# EAGLE design Internal A (EAGLE 7.5.0)
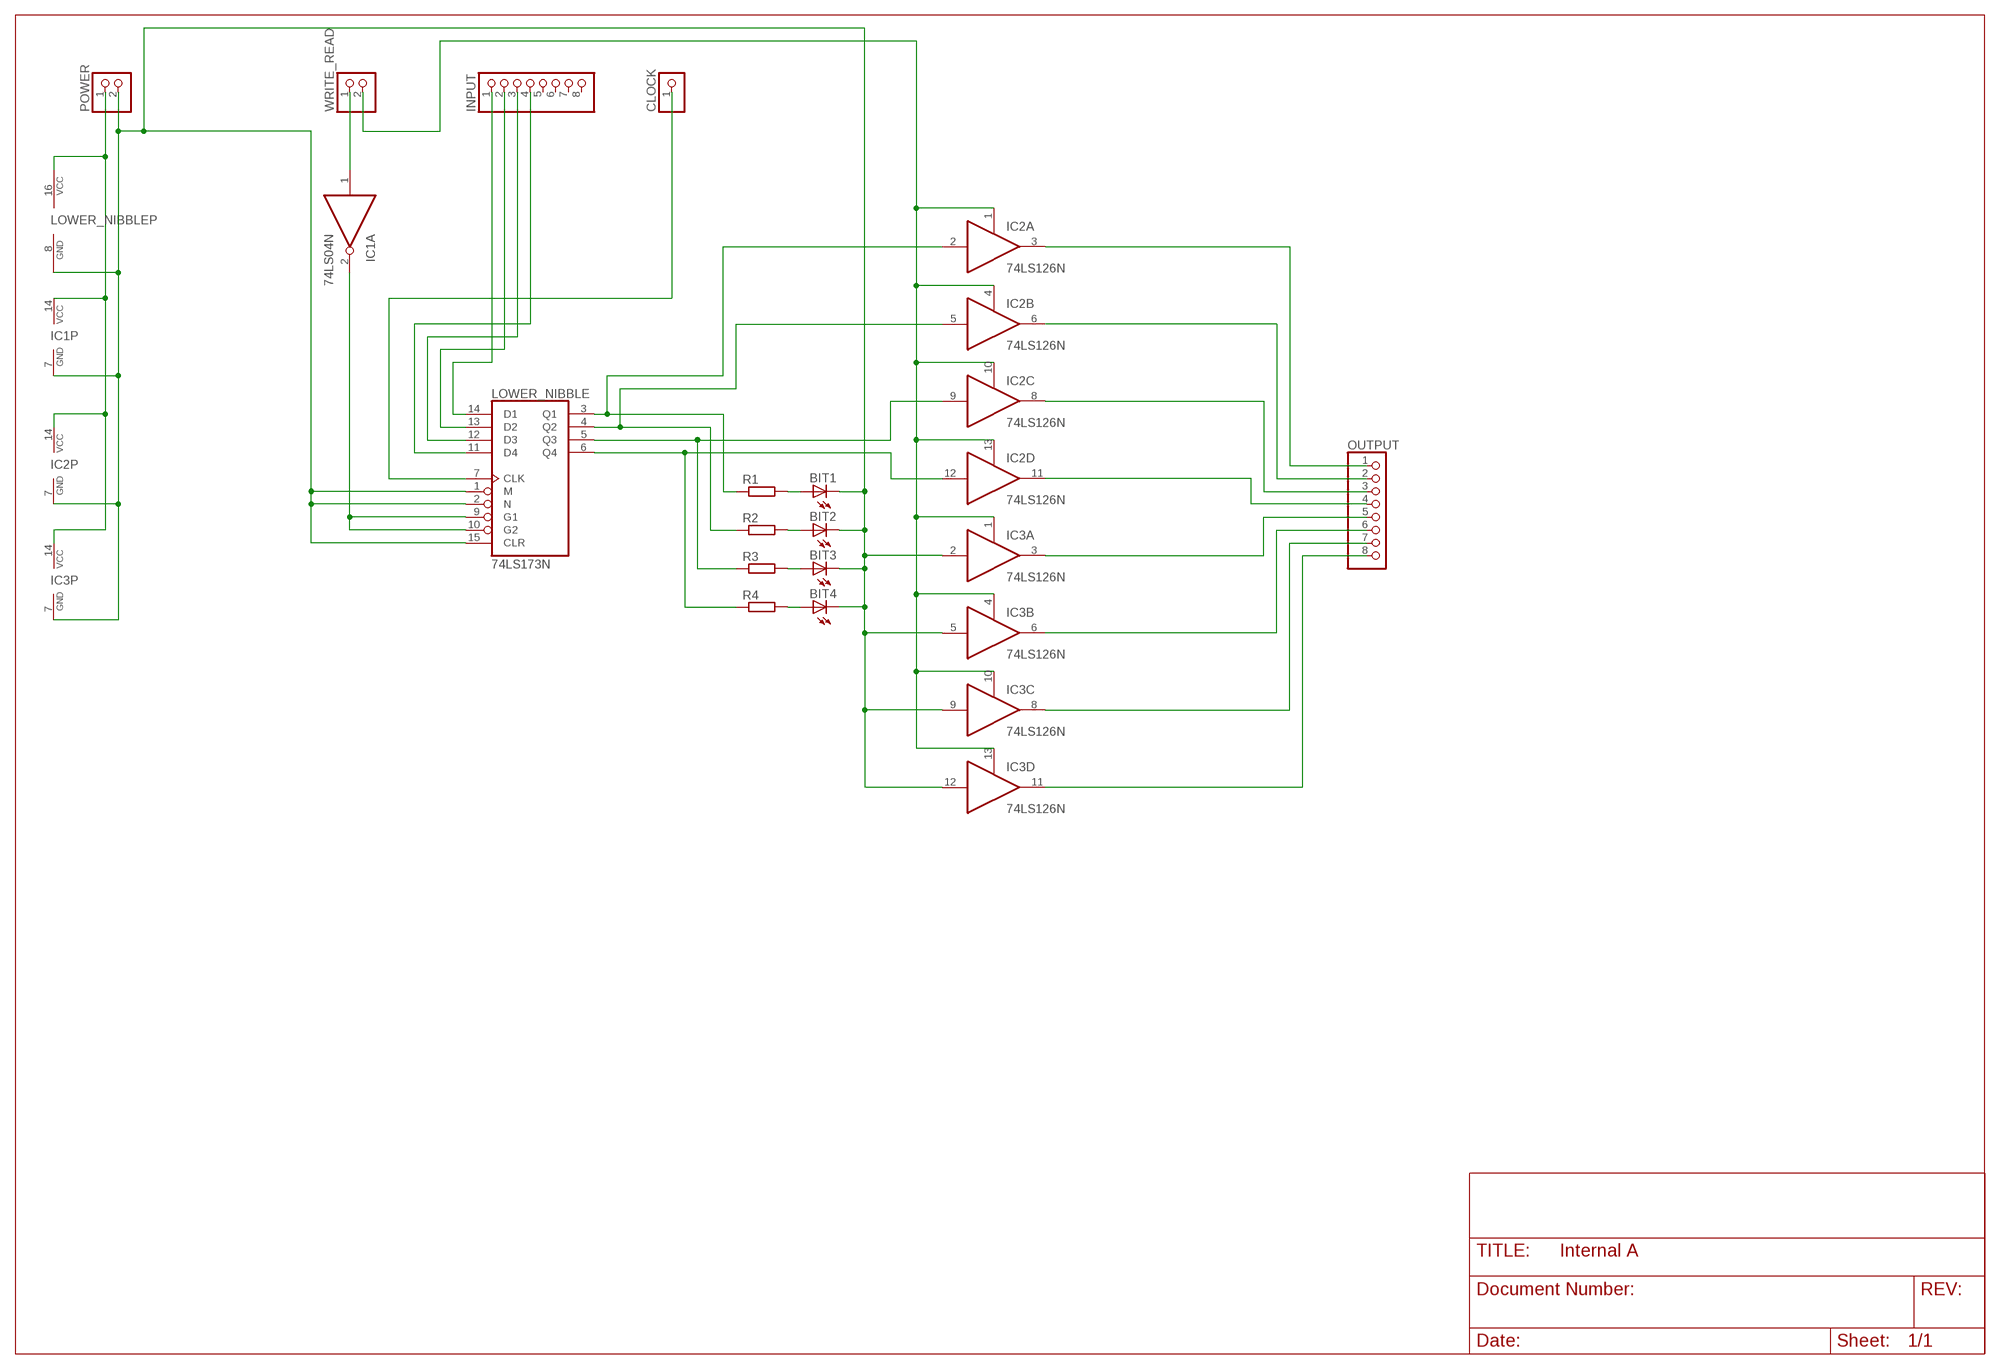
[diagram p0: schematic, sheet 1]

## Parts
BIT1  LED3MM  [LED3MM]
BIT2  LED3MM  [LED3MM]
BIT3  LED3MM  [LED3MM]
BIT4  LED3MM  [LED3MM]
CLOCK  PINHD-1X1  [1X01]
IC1  74LS04N  [DIL14]
IC2  74LS126N  [DIL14]
IC3  74LS126N  [DIL14]
INPUT  PINHD-1X8  [1X08]
LOWER_NIBBLE  74LS173N  [DIL16]
OUTPUT  PINHD-1X8  [1X08]
POWER  PINHD-1X2  [1X02]
R1  R-EU_0207/10  [0207/10]
R2  R-EU_0207/10  [0207/10]
R3  R-EU_0207/10  [0207/10]
R4  R-EU_0207/10  [0207/10]
WRITE_READ  PINHD-1X2  [1X02]

## Nets
GND: BIT1.K(C) BIT2.K(C) BIT3.K(C) BIT4.K(C) IC1.7(P:GND) IC2.7(P:GND) IC3.2(A:I) IC3.5(B:I) IC3.7(P:GND) IC3.9(C:I) IC3.12(D:I) LOWER_NIBBLE.1(M) LOWER_NIBBLE.2(N) LOWER_NIBBLE.8(GND) LOWER_NIBBLE.15(CLR) POWER.2
N$2: IC1.1(A:I) WRITE_READ.1
N$3: BIT1.A R1.2
N$5: BIT2.A R2.2
N$6: BIT3.A R3.2
N$7: BIT4.A R4.2
N$11: IC2.11(D:O) OUTPUT.4
N$12: IC1.2(A:O) LOWER_NIBBLE.9(G1) LOWER_NIBBLE.10(G2)
N$13: CLOCK.1 LOWER_NIBBLE.7(CLK)
N$14: INPUT.1 LOWER_NIBBLE.14(D1)
N$15: INPUT.2 LOWER_NIBBLE.13(D2)
N$16: INPUT.3 LOWER_NIBBLE.12(D3)
N$17: INPUT.4 LOWER_NIBBLE.11(D4)
N$22: IC2.2(A:I) LOWER_NIBBLE.3(Q1) R1.1
N$23: IC2.5(B:I) LOWER_NIBBLE.4(Q2) R2.1
N$24: IC2.9(C:I) LOWER_NIBBLE.5(Q3) R3.1
N$25: IC2.12(D:I) LOWER_NIBBLE.6(Q4) R4.1
N$30: IC2.1(A:OE) IC2.4(B:OE) IC2.10(C:OE) IC2.13(D:OE) IC3.1(A:OE) IC3.4(B:OE) IC3.10(C:OE) IC3.13(D:OE) WRITE_READ.2
N$31: IC2.3(A:O) OUTPUT.1
N$32: IC2.6(B:O) OUTPUT.2
N$33: IC2.8(C:O) OUTPUT.3
N$35: IC3.3(A:O) OUTPUT.5
N$36: IC3.6(B:O) OUTPUT.6
N$37: IC3.8(C:O) OUTPUT.7
N$38: IC3.11(D:O) OUTPUT.8
VCC: IC1.14(P:VCC) IC2.14(P:VCC) IC3.14(P:VCC) LOWER_NIBBLE.16(VCC) POWER.1
Unconnected: IC1.3(B:I) IC1.4(B:O) IC1.5(C:I) IC1.6(C:O) IC1.8(D:O) IC1.9(D:I) IC1.10(E:O) IC1.11(E:I) IC1.12(F:O) IC1.13(F:I) INPUT.5 INPUT.6 INPUT.7 INPUT.8

## Library data of the parts
BIT1-BIT4 = led:LED: LED OSRAM: - CHIPLED LG R971, LG N971, LY N971, LG Q971, LY Q971, LO R971, LY R971 LH N974, LH R974 LS Q976, LO Q976, LY Q976 LO Q996 - Hyper CHIPLED LW Q18S LB Q993, LB Q99A, LB R99A - SideLED LS A670, LO A670, LY A670, LG A670, LP A670 LB A673, LV A673, LT A673, LW A673 LH A674 LY A675 LS A676, LA A676, LO A676, LY A676, LW A676 LS A679, LY A679, LG A679 - Hyper Micro SIDELED® LS Y876, LA Y876, LO Y876, LY Y876 LT Y87S - SmartLED LW L88C, LW L88S LB L89C, LB L89S, LG L890 LS L89K, LO L89K, LY L89K LS L896, LA L896, LO L896, LY L896 - TOPLED LS T670, LO T670, LY T670, LG T670, LP T670 LSG T670, LSP T670, LSY T670, LOP T670, LYG T670 LG T671, LOG T671, LSG T671 LB T673, LV T673, LT T673, LW T673 LH T674 LS T676, LA T676, LO T676, LY T676, LB T676, LH T676, LSB T676, LW T676 LB T67C, LV T67C, LT T67C, LS T67K, LO T67K, LY T67K, LW E67C LS E67B, LA E67B, LO E67B, LY E67B, LB E67C, LV E67C, LT E67C LW T67C LS T679, LY T679, LG T679 LS T770, LO T770, LY T770, LG T770, LP T770 LB T773, LV T773, LT T773, LW T773 LH T774 LS E675, LA E675, LY E675, LS T675 LS T776, LA T776, LO T776, LY T776, LB T776 LHGB T686 LT T68C, LB T68C - Hyper Mini TOPLED® LB M676 - Mini TOPLED Santana® LG M470 LS M47K, LO M47K, LY M47K Source: http://www.osram.convergy.de LUXEON: - LUMILED® LXK2-PW12-R00, LXK2-PW12-S00, LXK2-PW14-U00, LXK2-PW14-V00 LXK2-PM12-R00, LXK2-PM12-S00, LXK2-PM14-U00 LXK2-PE12-Q00, LXK2-PE12-R00, LXK2-PE12-S00, LXK2-PE14-T00, LXK2-PE14-U00 LXK2-PB12-K00, LXK2-PB12-L00, LXK2-PB12-M00, LXK2-PB14-N00, LXK2-PB14-P00, LXK2-PB14-Q00 LXK2-PR12-L00, LXK2-PR12-M00, LXK2-PR14-Q00, LXK2-PR14-R00 LXK2-PD12-Q00, LXK2-PD12-R00, LXK2-PD12-S00 LXK2-PH12-R00, LXK2-PH12-S00 LXK2-PL12-P00, LXK2-PL12-Q00, LXK2-PL12-R00 Source: www.luxeon.com KINGBRIGHT: KA-3528ASYC Source: www.kingbright.com
CLOCK = pinhead:PINHD-1X1: PIN HEADER
IC1 = 74xx-eu:74*04: Hex INVERTER
IC2 IC3 = 74xx-eu:74*126: Quad bus BUFFER, 3-state
INPUT OUTPUT = pinhead:PINHD-1X8: PIN HEADER
LOWER_NIBBLE = 74xx-us:74*173: 4-bit D type REGISTER, 3-state
POWER WRITE_READ = pinhead:PINHD-1X2: PIN HEADER
R1-R4 = resistor:R-EU_: RESISTOR, European symbol

## Board
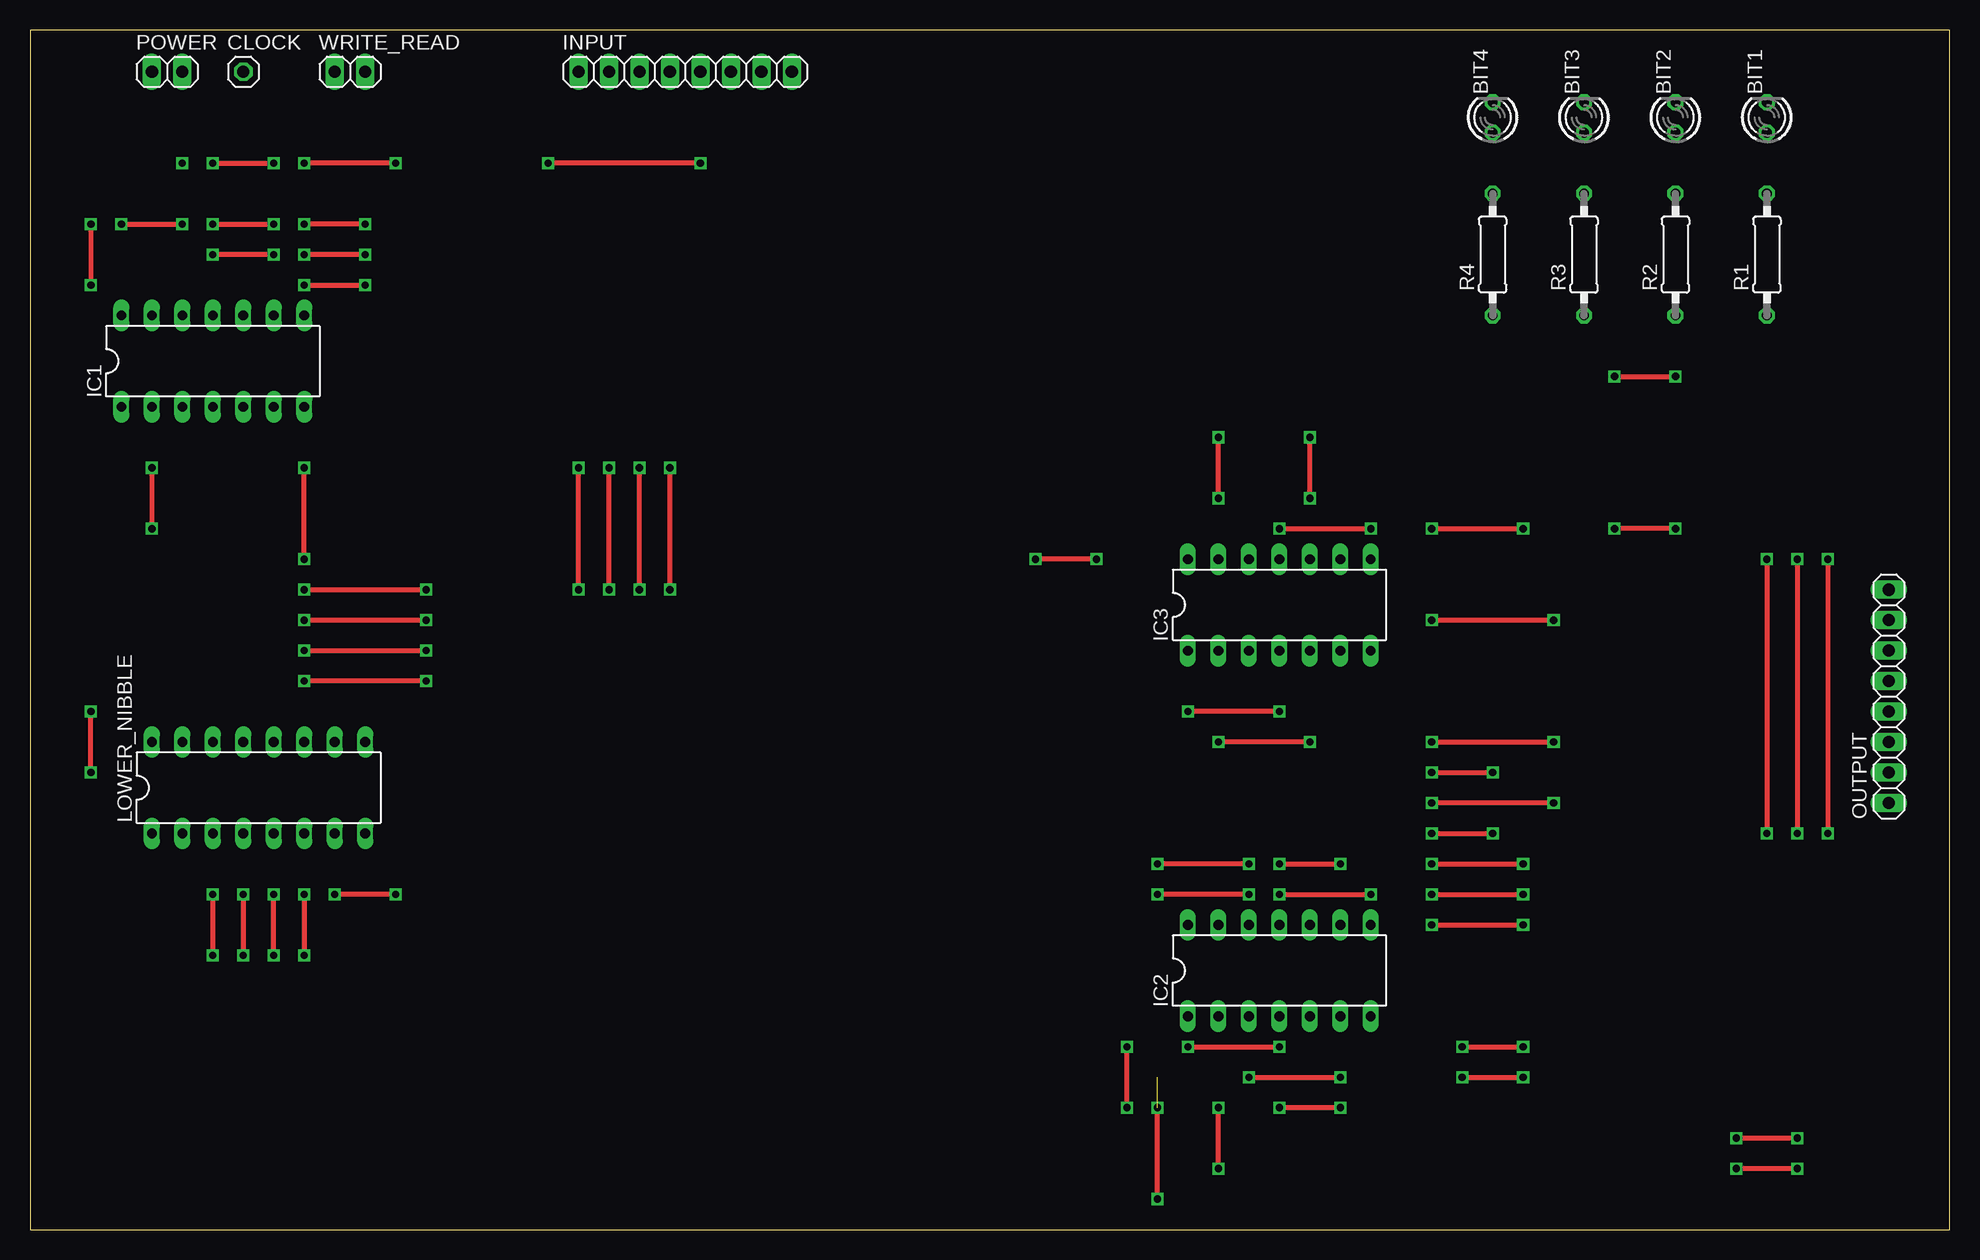
[diagram p1: board, top side]
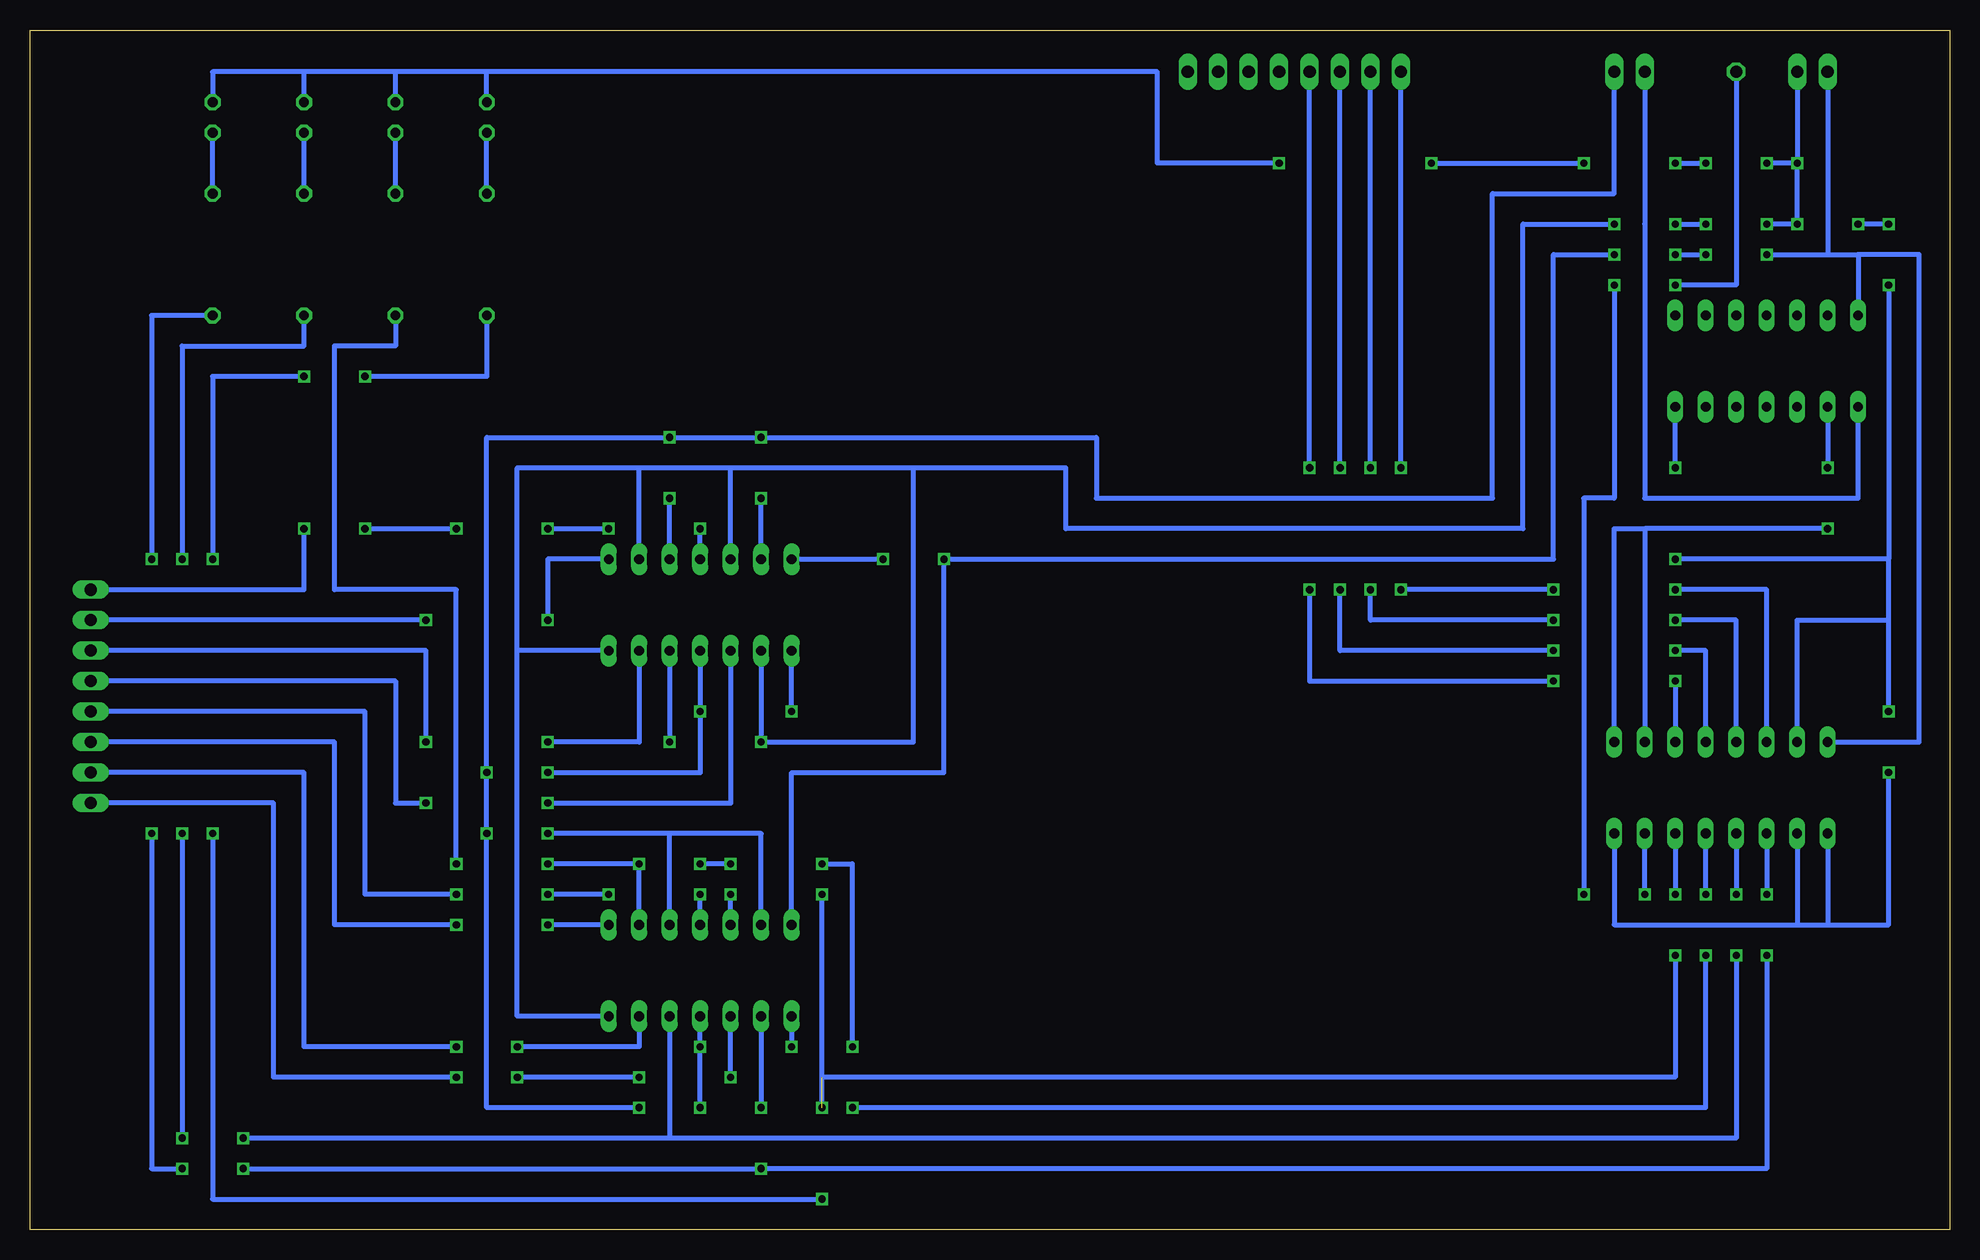
[diagram p2: board, bottom side, seen from below]

Size 160 x 100 mm. Coordinates in mm from the lower left corner, seen from the top.
Outline: 0,0 160,0 160,100 0,100 0,0
Copper layers (1*16): Top 0.035mm / dielectric 1.5mm / Bottom 0.035mm
Design rules "default": minimum track width 10mil, minimum drill 24mil, track to track 8mil, track to pad 8mil, pad to pad 8mil, via to via 8mil, smd to smd 8mil, copper to edge 40mil, drill to drill 8mil, minimum pad ring 10mil, minimum via ring 8mil, stop-mask expansion 4mil, vias tented up to drill 0mil, thermal gap 10mil

### Footprints (pad centres in the part's own frame; a part is rotated, then mirrored left to right if it is on the bottom)
LED3MM = drill 0.813 octagon: A -1.27,0; K 1.27,0
1X01 = drill 1.016 octagon: 1 0,0
DIL14 = drill 0.813 long: 1 -7.62,-3.81; 2 -5.08,-3.81; 3 -2.54,-3.81; 4 0,-3.81; 5 2.54,-3.81; 6 5.08,-3.81; 7 7.62,-3.81; 8 7.62,3.81; 9 5.08,3.81; 10 2.54,3.81; 11 0,3.81; 12 -2.54,3.81; 13 -5.08,3.81; 14 -7.62,3.81
1X08 = drill 1.016 long: 1 -8.89,0; 2 -6.35,0; 3 -3.81,0; 4 -1.27,0; 5 1.27,0; 6 3.81,0; 7 6.35,0; 8 8.89,0
DIL16 = drill 0.813 long: 1 -8.89,-3.81; 2 -6.35,-3.81; 3 -3.81,-3.81; 4 -1.27,-3.81; 5 1.27,-3.81; 6 3.81,-3.81; 7 6.35,-3.81; 8 8.89,-3.81; 9 8.89,3.81; 10 6.35,3.81; 11 3.81,3.81; 12 1.27,3.81; 13 -1.27,3.81; 14 -3.81,3.81; 15 -6.35,3.81; 16 -8.89,3.81
1X02 = drill 1.016 long: 1 -1.27,0; 2 1.27,0
0207/10 = drill 0.813 octagon: 1 -5.08,0; 2 5.08,0

### Placement (x,y rotation side)
BIT1  144.78,92.71 90 top
BIT2  137.16,92.71 90 top
BIT3  129.54,92.71 90 top
BIT4  121.92,92.71 90 top
CLOCK  17.78,96.52 0 top
IC1  15.24,72.39 0 top
IC2  104.14,21.59 0 top
IC3  104.14,52.07 0 top
INPUT  54.61,96.52 0 top
LOWER_NIBBLE  19.05,36.83 0 top
OUTPUT  154.94,44.45 90 top
POWER  11.43,96.52 0 top
R1  144.78,81.28 90 top
R2  137.16,81.28 90 top
R3  129.54,81.28 90 top
R4  121.92,81.28 90 top
WRITE_READ  26.67,96.52 0 top

### Tracks (layer width: path | path; a pad name or v marks a point on that pad's centre or on a via)
GND  (via drill 0.6)
  Top 0.406: v5.08,83.82 v5.08,78.74 | v22.86,55.88 v22.86,63.5 | v5.08,38.1 v5.08,43.18 | v27.94,83.82 v22.86,83.82 | v30.48,88.9 v22.86,88.9 | v55.88,88.9 v43.18,88.9 | v106.68,40.64 v99.06,40.64 | v15.24,88.9 v20.32,88.9 | v15.24,83.82 v20.32,83.82 | v7.62,83.82 v12.7,83.82
  Bottom 0.406: POWER.2 v12.7,88.9 | v5.08,78.74 5.08,55.88 | 5.08,55.88 v22.86,55.88 | v22.86,63.5 IC1.7 | 12.7,25.4 10.16,25.4 | 10.16,25.4 5.08,25.4 v5.08,38.1 | v5.08,43.18 5.08,50.8 | 5.08,50.8 5.08,55.88 | LOWER_NIBBLE.1 10.16,25.4 | LOWER_NIBBLE.2 12.7,25.4 | LOWER_NIBBLE.15 12.7,50.8 5.08,50.8 | v27.94,83.82 35.56,83.82 35.56,58.42 73.66,58.42 73.66,63.5 86.36,63.5 | v22.86,83.82 v20.32,83.82 | 119.38,48.26 119.38,17.78 IC2.7 | 119.38,48.26 119.38,63.5 109.22,63.5 | v43.18,88.9 v30.48,88.9 | v22.86,88.9 v20.32,88.9 | 86.36,63.5 101.6,63.5 | 101.6,63.5 109.22,63.5 | 121.92,96.52 66.04,96.52 66.04,88.9 v55.88,88.9 | 121.92,96.52 129.54,96.52 | 129.54,96.52 137.16,96.52 | 137.16,96.52 144.78,96.52 BIT1.K | BIT4.K 121.92,96.52 | BIT3.K 129.54,96.52 | BIT2.K 137.16,96.52 | IC3.7 119.38,48.26 | IC3.5 v106.68,40.64 | 86.36,63.5 86.36,40.64 v99.06,40.64 IC3.2 | IC3.9 109.22,63.5 | IC3.12 101.6,63.5 | LOWER_NIBBLE.8 27.94,25.4 12.7,25.4 | v12.7,88.9 v15.24,88.9 | v15.24,83.82 v12.7,83.82 v12.7,88.9 | v5.08,83.82 v7.62,83.82
N$2
  Bottom 0.406: WRITE_READ.1 25.4,83.82 25.4,60.96 7.62,60.96 IC1.1
N$3
  Bottom 0.406: R1.2 BIT1.A
N$5
  Bottom 0.406: R2.2 BIT2.A
N$6
  Bottom 0.406: R3.2 BIT3.A
N$7
  Bottom 0.406: R4.2 BIT4.A
N$11  (via drill 0.6)
  Top 0.406: v104.14,27.94 v111.76,27.94 | v116.84,27.94 v124.46,27.94
  Bottom 0.406: IC2.11 v104.14,27.94 | v111.76,27.94 v116.84,27.94 | v124.46,27.94 132.08,27.94 132.08,43.18 OUTPUT.4
N$12  (via drill 0.6)
  Top 0.406: v10.16,63.5 v10.16,58.42
  Bottom 0.406: IC1.2 v10.16,63.5 | v10.16,58.42 25.4,58.42 | 25.4,58.42 LOWER_NIBBLE.10 | LOWER_NIBBLE.9 27.94,58.42 25.4,58.42
N$13  (via drill 0.6)
  Top 0.406: v22.86,78.74 v27.94,78.74 | v30.48,27.94 v25.4,27.94
  Bottom 0.406: CLOCK.1 17.78,78.74 v22.86,78.74 | v27.94,78.74 27.94,60.96 30.48,60.96 v30.48,27.94 | v25.4,27.94 LOWER_NIBBLE.7
N$14  (via drill 0.6)
  Top 0.406: v22.86,53.34 v33.02,53.34 | v45.72,53.34 v45.72,63.5
  Bottom 0.406: LOWER_NIBBLE.14 15.24,53.34 v22.86,53.34 | v33.02,53.34 v45.72,53.34 | v45.72,63.5 INPUT.1
N$15  (via drill 0.6)
  Top 0.406: v22.86,50.8 v33.02,50.8 | v48.26,53.34 v48.26,63.5
  Bottom 0.406: LOWER_NIBBLE.13 17.78,50.8 v22.86,50.8 | v33.02,50.8 48.26,50.8 v48.26,53.34 | v48.26,63.5 INPUT.2
N$16  (via drill 0.6)
  Top 0.406: v22.86,48.26 v33.02,48.26 | v50.8,53.34 v50.8,63.5
  Bottom 0.406: LOWER_NIBBLE.12 20.32,48.26 v22.86,48.26 | v33.02,48.26 50.8,48.26 v50.8,53.34 | v50.8,63.5 INPUT.3
N$17  (via drill 0.6)
  Top 0.406: v33.02,45.72 v22.86,45.72 | v53.34,53.34 v53.34,63.5
  Bottom 0.406: v33.02,45.72 53.34,45.72 v53.34,53.34 | v22.86,45.72 LOWER_NIBBLE.11 | v53.34,63.5 INPUT.4
N$22  (via drill 0.6)
  Top 0.406: v15.24,27.94 v15.24,22.86 | v99.06,5.08 v99.06,10.16 | v149.86,55.88 v149.86,33.02 | v147.32,5.08 v142.24,5.08
  Bottom 0.406: LOWER_NIBBLE.3 v15.24,27.94 | v15.24,22.86 15.24,5.08 v99.06,5.08 v142.24,5.08 | v149.86,33.02 149.86,5.08 v147.32,5.08 | R1.1 149.86,76.2 v149.86,55.88 | IC2.2 v99.06,10.16
N$23  (via drill 0.6)
  Top 0.406: v17.78,27.94 v17.78,22.86 | v147.32,55.88 v147.32,33.02 | v147.32,7.62 v142.24,7.62
  Bottom 0.406: LOWER_NIBBLE.4 v17.78,27.94 | v17.78,22.86 17.78,7.62 106.68,7.62 | 106.68,7.62 v142.24,7.62 | v147.32,33.02 v147.32,7.62 | v147.32,55.88 147.32,73.66 137.16,73.66 R2.1 | IC2.5 106.68,7.62
N$24  (via drill 0.6)
  Top 0.406: v91.44,10.16 v91.44,15.24 | v101.6,30.48 v93.98,30.48 | v116.84,30.48 v124.46,30.48 | v20.32,22.86 v20.32,27.94 | v104.14,30.48 v109.22,30.48
  Bottom 0.406: v91.44,10.16 20.32,10.16 v20.32,22.86 | v91.44,15.24 91.44,30.48 v93.98,30.48 | v116.84,30.48 v109.22,30.48 IC2.9 | R3.1 129.54,73.66 134.62,73.66 134.62,53.34 124.46,53.34 v124.46,30.48 | v20.32,27.94 LOWER_NIBBLE.5 | v101.6,30.48 v104.14,30.48
N$25  (via drill 0.6)  (1 unrouted)
  Top 0.406: v22.86,27.94 v22.86,22.86 | v144.78,55.88 v144.78,33.02 | v93.98,2.54 v93.98,10.16 | v101.6,27.94 v93.98,27.94 | v132.08,71.12 v137.16,71.12
  Bottom 0.406: LOWER_NIBBLE.6 v22.86,27.94 | v93.98,10.16 93.98,12.7 | 93.98,12.7 v93.98,27.94 | v144.78,33.02 144.78,2.54 v93.98,2.54 | R4.1 121.92,71.12 v132.08,71.12 | v137.16,71.12 144.78,71.12 v144.78,55.88 | IC2.12 v101.6,27.94 | v22.86,22.86 22.86,12.7 93.98,12.7
N$30  (via drill 0.6)
  Top 0.406: v99.06,60.96 v99.06,66.04 | v116.84,33.02 v121.92,33.02 | v116.84,38.1 v121.92,38.1 | v106.68,60.96 v106.68,66.04 | v104.14,43.18 v96.52,43.18 | v96.52,15.24 v104.14,15.24 | v109.22,10.16 v104.14,10.16
  Bottom 0.406: WRITE_READ.2 27.94,86.36 38.1,86.36 38.1,60.96 71.12,60.96 71.12,66.04 v99.06,66.04 v106.68,66.04 121.92,66.04 v121.92,38.1 v121.92,33.02 121.92,10.16 v109.22,10.16 | 106.68,33.02 99.06,33.02 IC2.13 | 106.68,33.02 v116.84,33.02 | v116.84,38.1 104.14,38.1 v104.14,43.18 IC3.4 | IC3.10 v106.68,60.96 | IC3.13 v99.06,60.96 | v96.52,43.18 IC3.1 | IC2.1 v96.52,15.24 | IC2.4 v104.14,15.24 v104.14,10.16 | IC2.10 106.68,33.02
N$31  (via drill 0.6)
  Top 0.406: v101.6,12.7 v109.22,12.7 | v119.38,12.7 v124.46,12.7
  Bottom 0.406: v109.22,12.7 v119.38,12.7 | v124.46,12.7 139.7,12.7 139.7,35.56 OUTPUT.1 | v101.6,12.7 IC2.3
N$32  (via drill 0.6)
  Top 0.406: v119.38,15.24 v124.46,15.24
  Bottom 0.406: v119.38,15.24 109.22,15.24 IC2.6 | OUTPUT.2 137.16,38.1 137.16,15.24 v124.46,15.24
N$33  (via drill 0.6)
  Top 0.406: v116.84,25.4 v124.46,25.4
  Bottom 0.406: v124.46,25.4 134.62,25.4 134.62,40.64 OUTPUT.3 | IC2.8 v116.84,25.4
N$35  (via drill 0.6)
  Top 0.406: v127,35.56 v116.84,35.56
  Bottom 0.406: OUTPUT.5 129.54,45.72 129.54,35.56 v127,35.56 | IC3.3 101.6,35.56 v116.84,35.56
N$36  (via drill 0.6)
  Top 0.406: v116.84,40.64 v127,40.64
  Bottom 0.406: v116.84,40.64 109.22,40.64 IC3.6 | v127,40.64 127,48.26 OUTPUT.6
N$37  (via drill 0.6)
  Top 0.406: v116.84,50.8 v127,50.8
  Bottom 0.406: v127,50.8 OUTPUT.7 | v116.84,50.8 116.84,55.88 IC3.8
N$38  (via drill 0.6)
  Top 0.406: v116.84,58.42 v124.46,58.42 | v137.16,58.42 v132.08,58.42 | v104.14,58.42 v111.76,58.42
  Bottom 0.406: v116.84,58.42 v111.76,58.42 | OUTPUT.8 137.16,53.34 v137.16,58.42 | v132.08,58.42 v124.46,58.42 | IC3.11 v104.14,58.42
VCC  (via drill 0.6)
  Top 0.406: v88.9,55.88 v83.82,55.88 | v27.94,81.28 v22.86,81.28 | v20.32,81.28 v15.24,81.28
  Bottom 0.406: v15.24,81.28 10.16,81.28 | 10.16,81.28 7.62,81.28 | 7.62,81.28 IC1.14 | LOWER_NIBBLE.16 2.54,40.64 2.54,81.28 7.62,81.28 | IC3.14 v88.9,55.88 | v27.94,81.28 33.02,81.28 33.02,55.88 v83.82,55.88 83.82,38.1 96.52,38.1 IC2.14 | v22.86,81.28 v20.32,81.28 | POWER.1 10.16,81.28